# EasyEDA Pro project WhaleTagRecovery_3v2r1_EasyEDA.epro

# Schematic Schematic

## Sheets
1 MCU: Create Date: 2024-01-31; Page Name: MCU; Project Name: RecoveryBoard_W24Edits; Schematic Name: Schematic; Update Date: 2024-02-20; Company: EasyEDA.com; Drawed: EasyEDA Pro; Page Size: A4; Part Number: JLCPCB-002; Reviewed: EasyEDA Pro; Version: V2.3
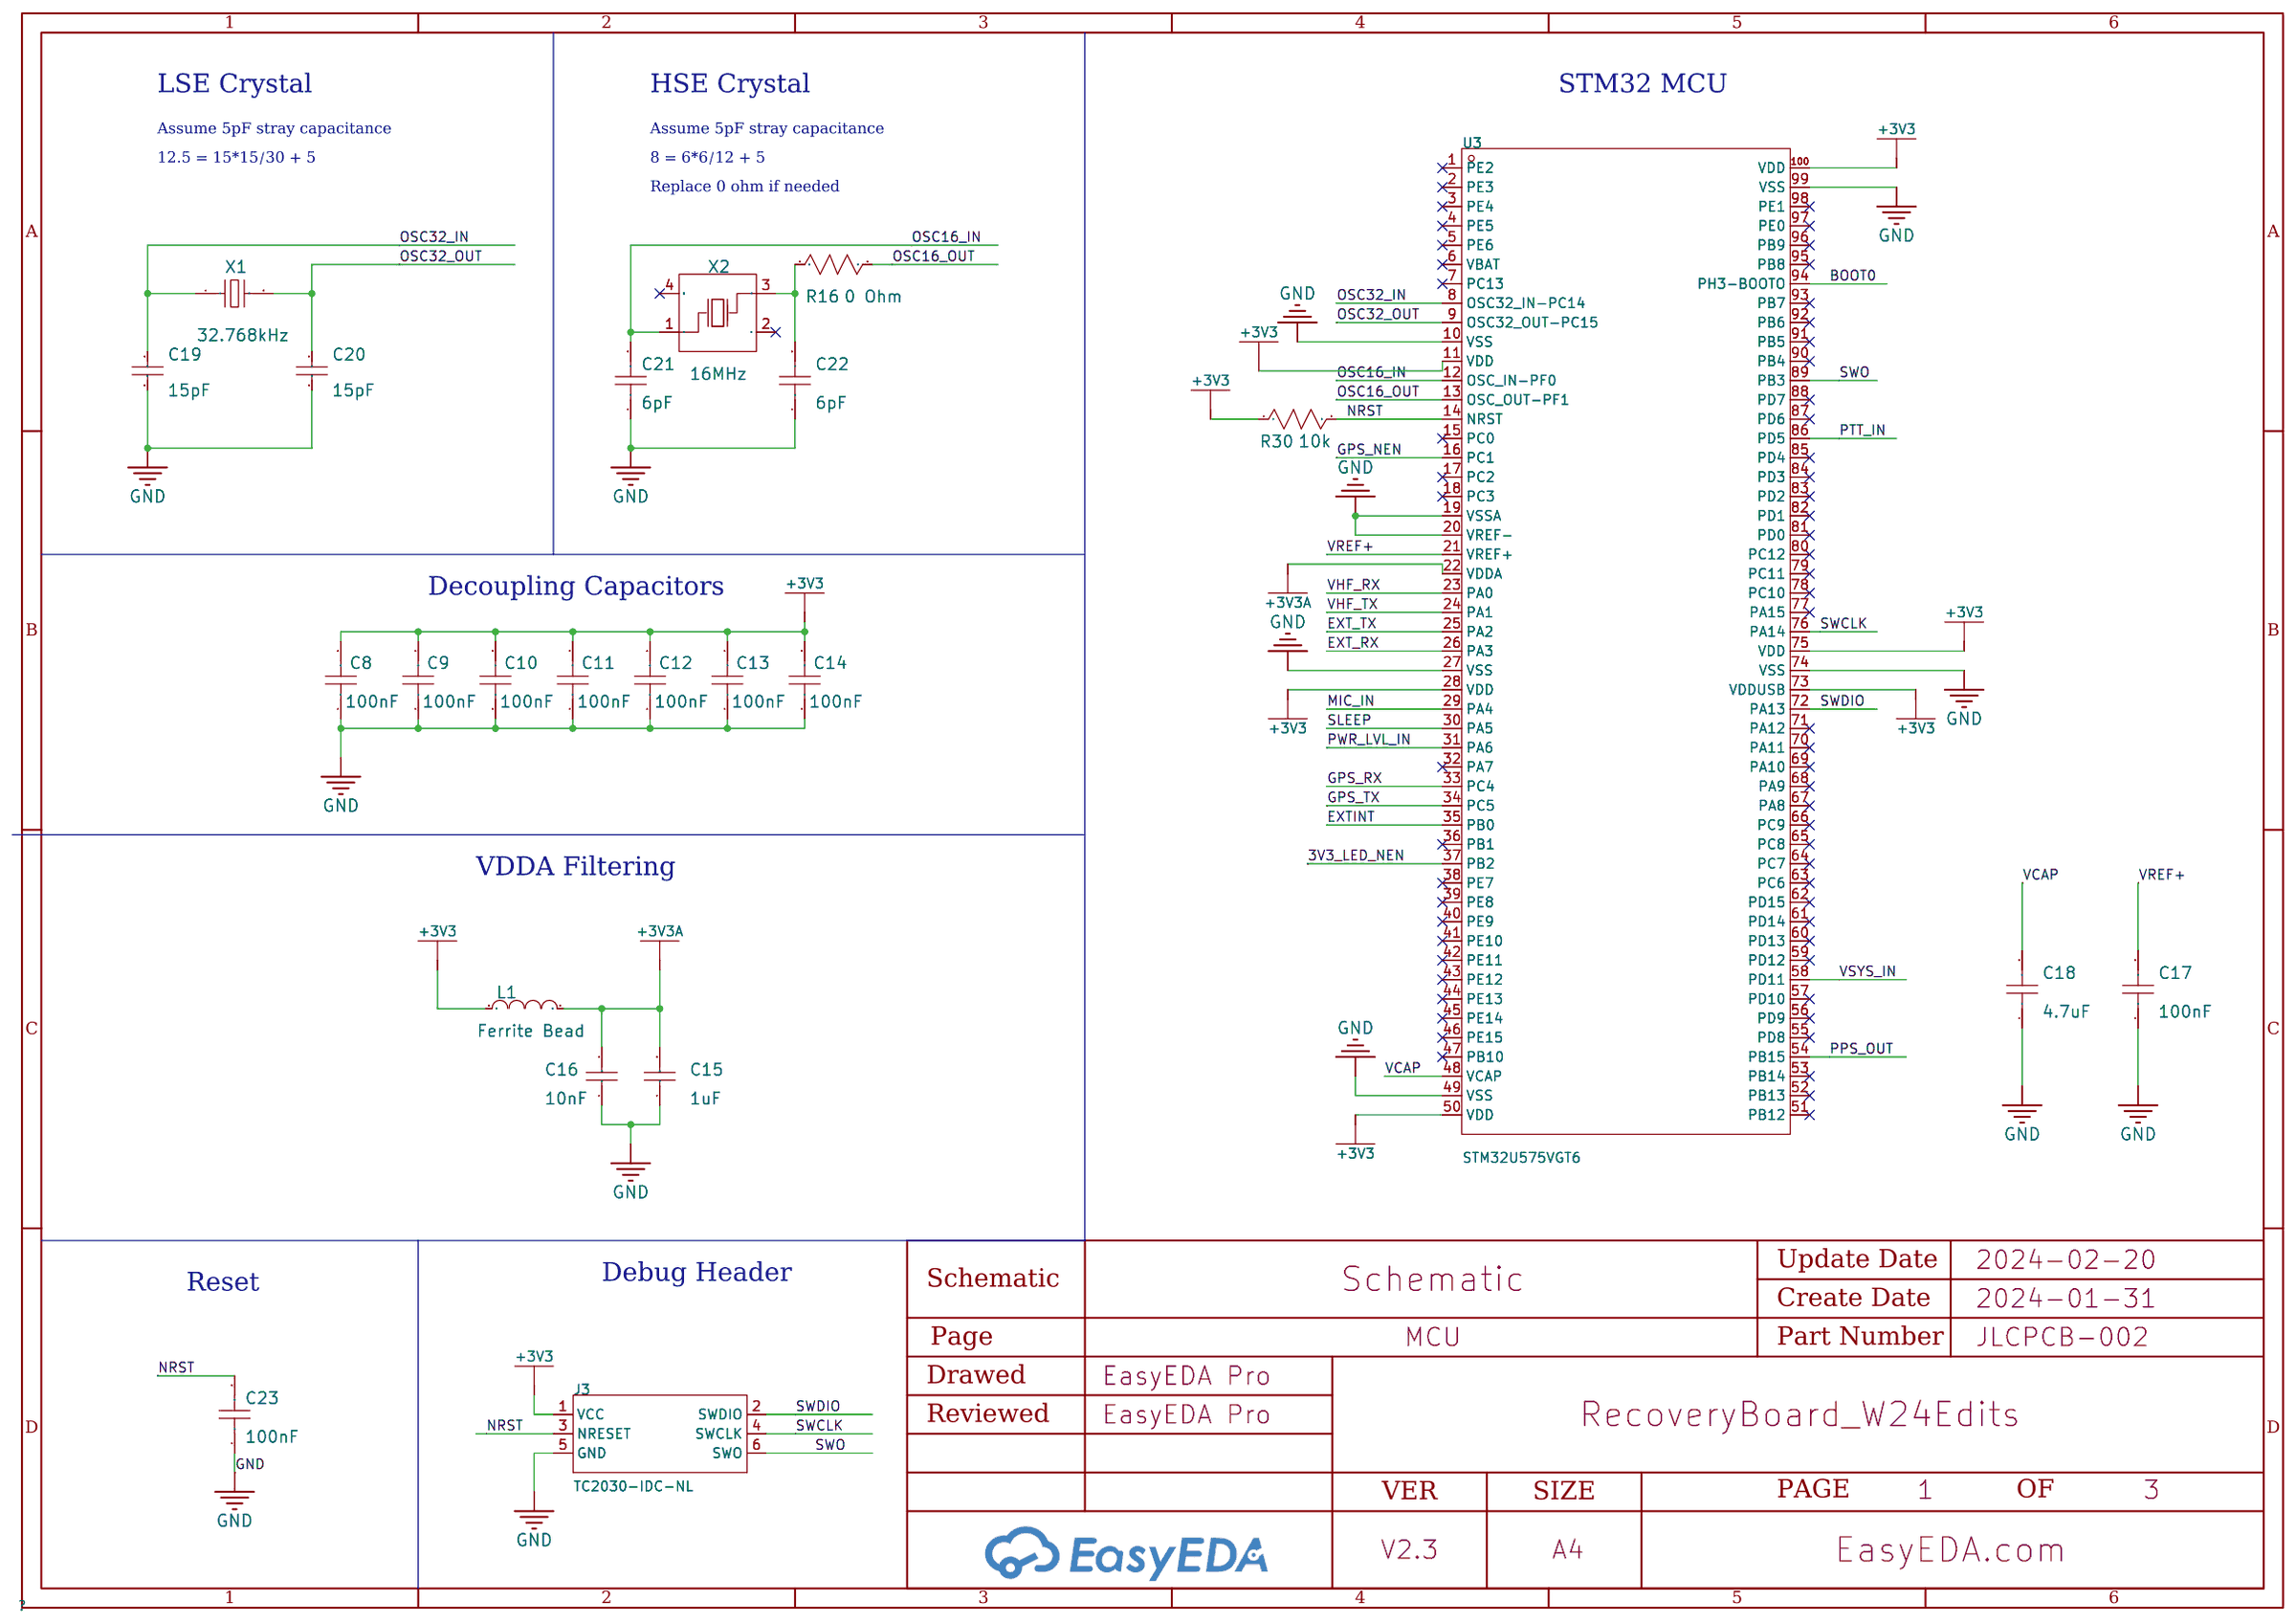
[diagram p0: MCU]
2 Recovery: Page Name: Recovery; Update Date: 2024-04-04
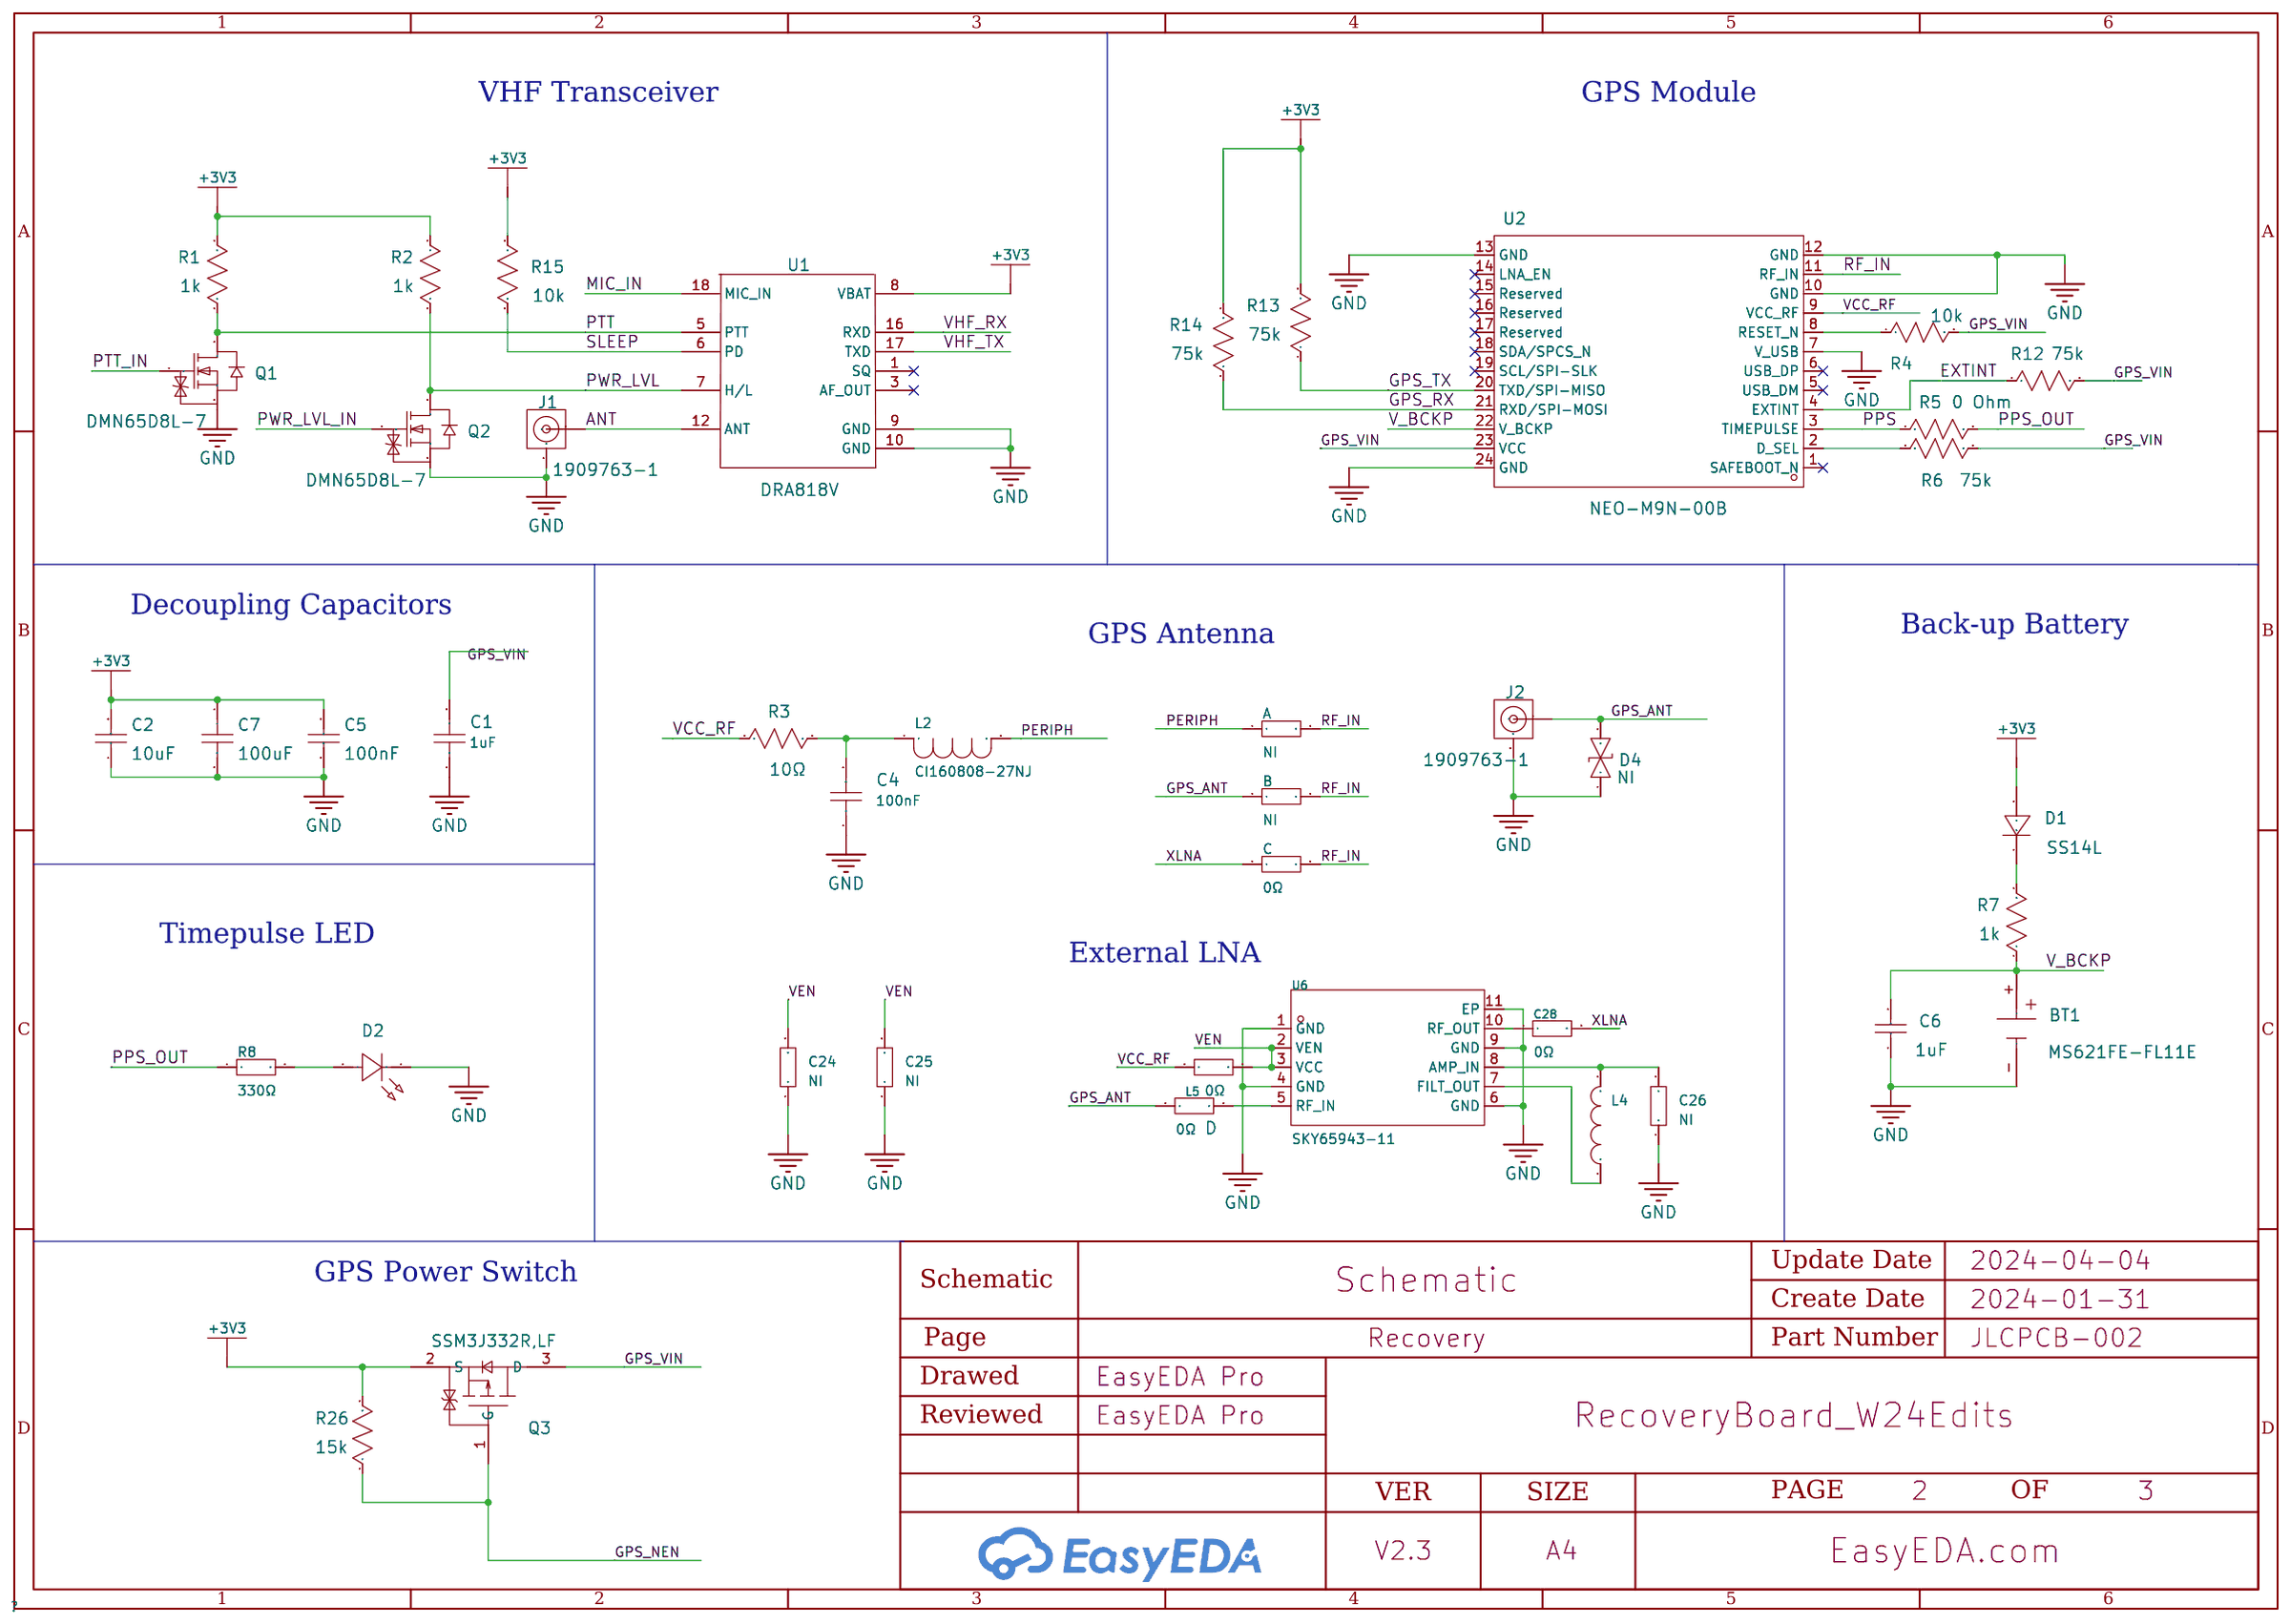
[diagram p1: Recovery]
3 Power: Page Name: Power
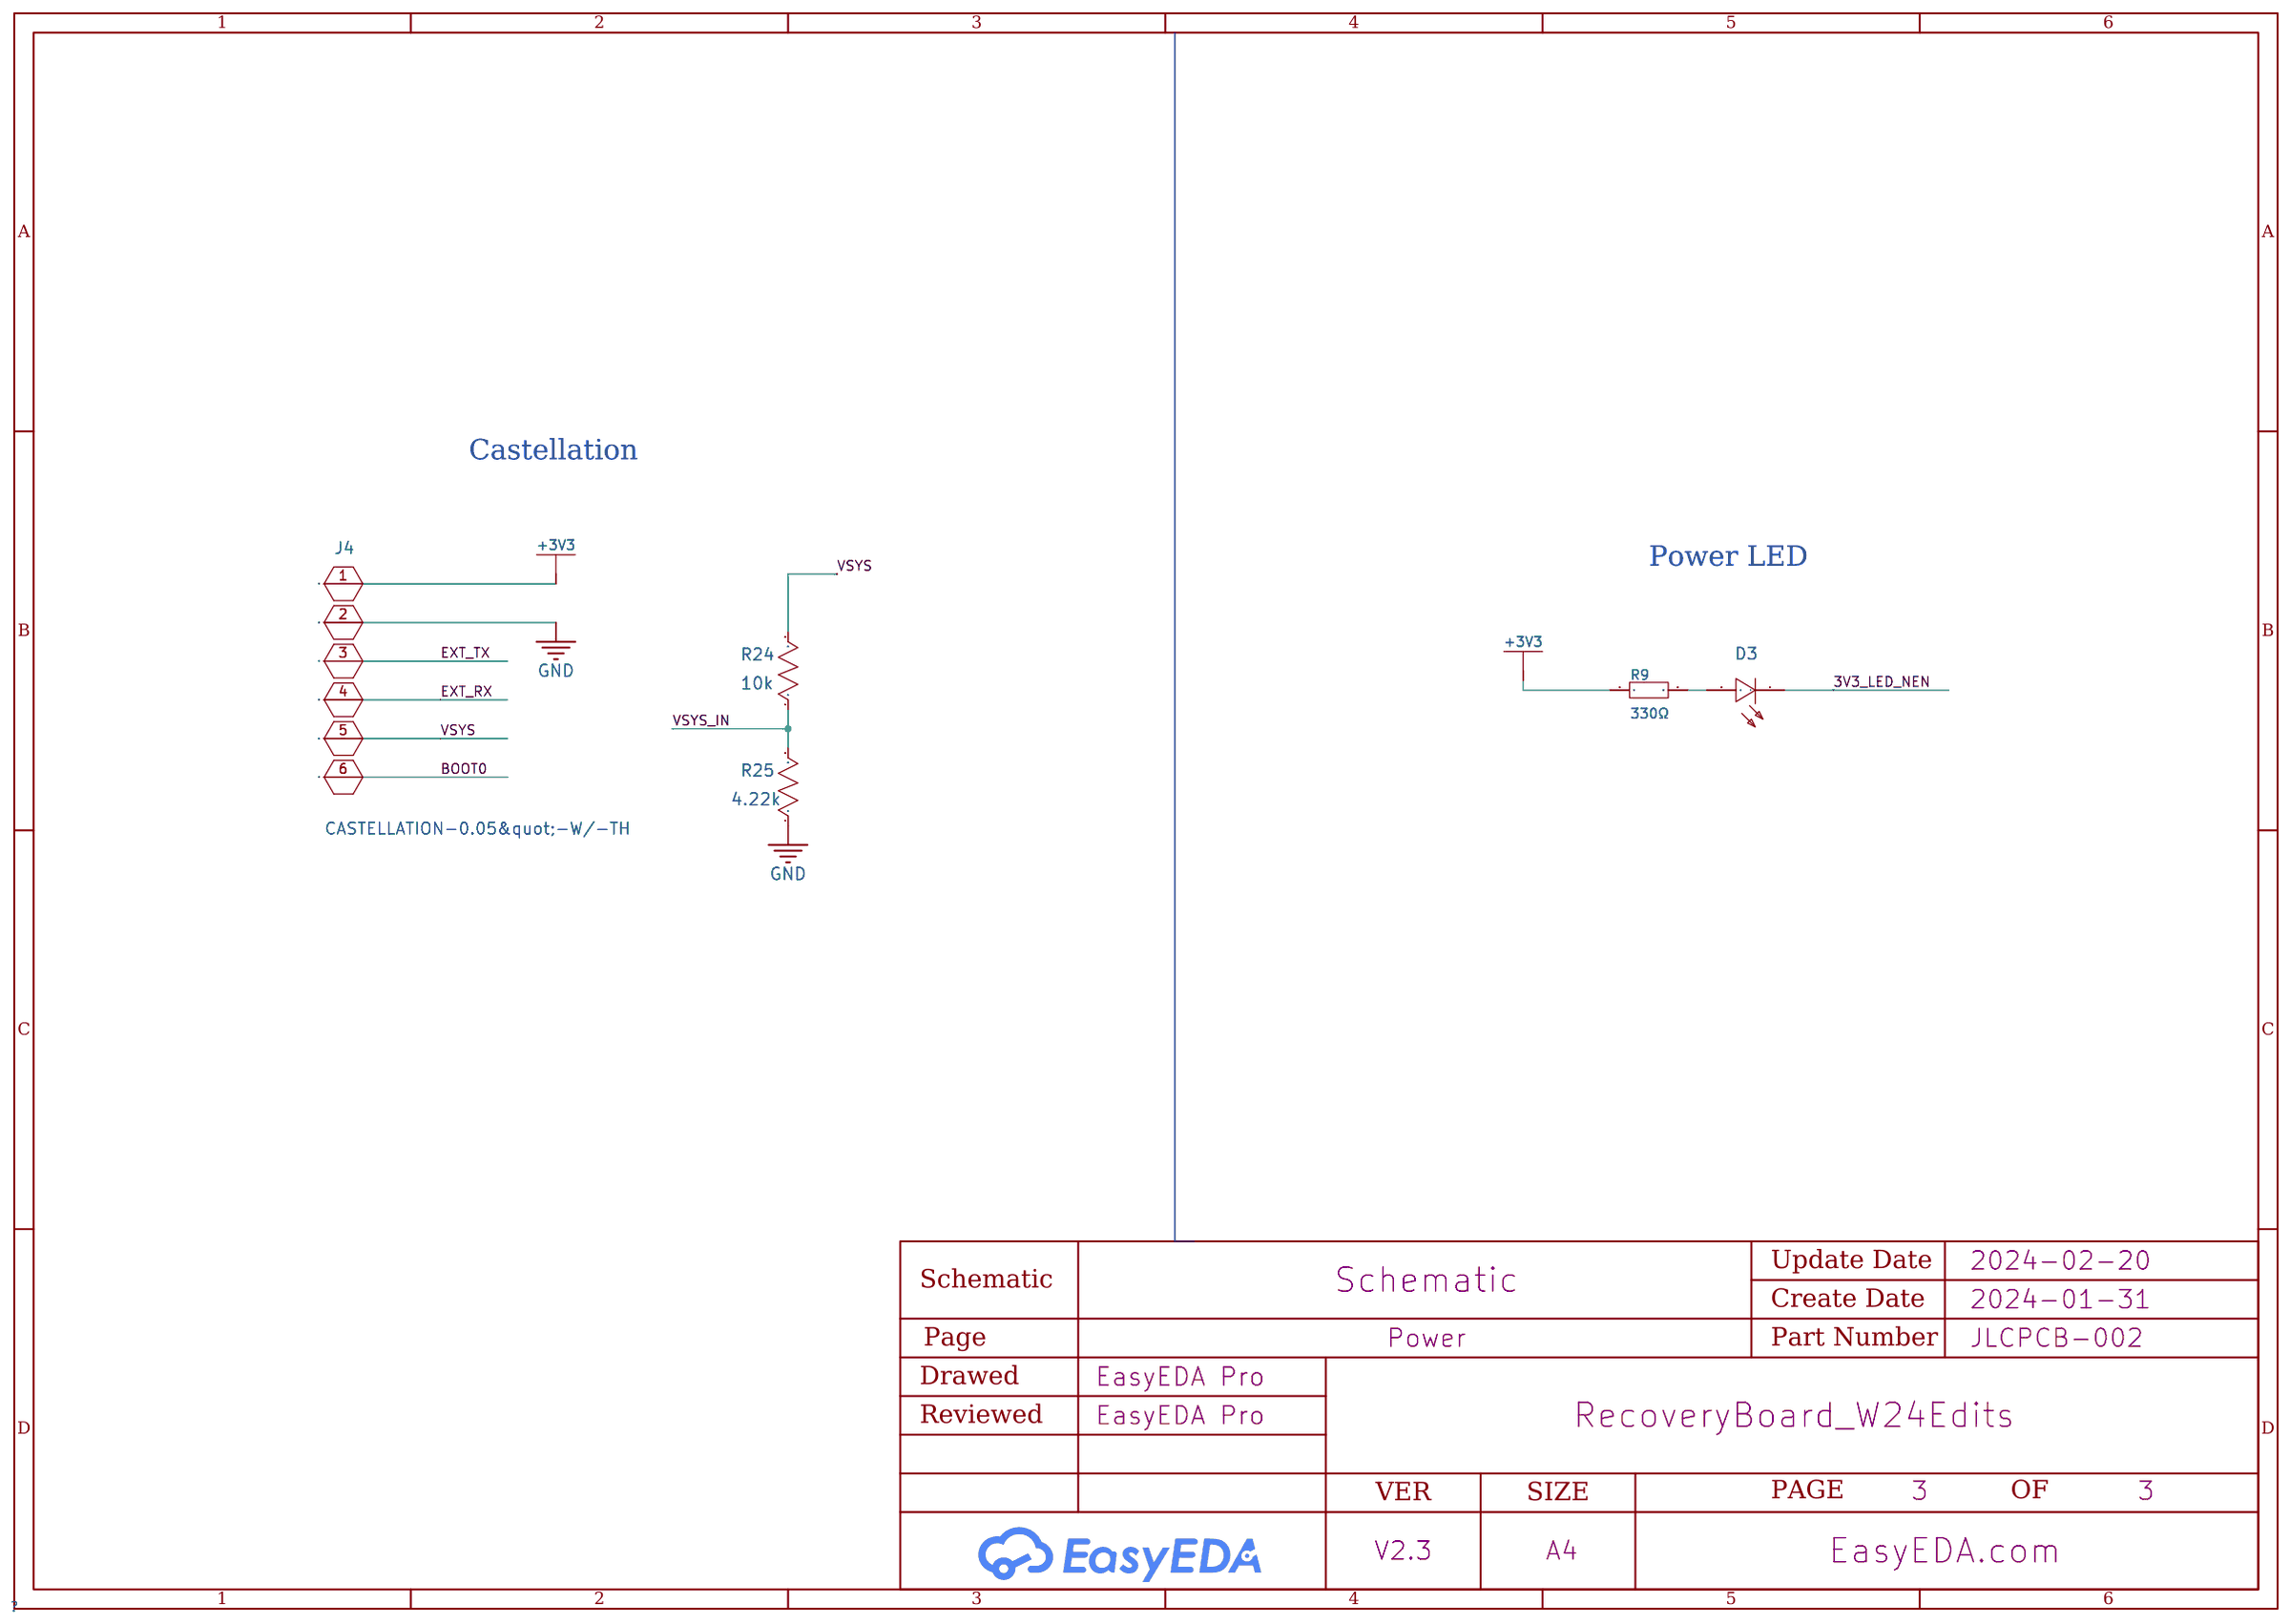
[diagram p2: Power]

## Parts
sheet MCU
C8  100nF  [C0402]
C9  100nF  [C0402]
C10  100nF  [C0402]
C11  100nF  [C0402]
C12  100nF  [C0402]
C13  100nF  [C0402]
C14  100nF  [C0402]
C15  1uF  [C0402]
C16  10nF  [C0402]
C17  100nF  [C0402]
C18  4.7uF  [C0603]
C19  15pF  [C0402]
C20  15pF  [C0402]
C21  6pF  [C0402]
C22  6pF  [C0402]
C23  100nF  [C0402]
J3  TC2030-IDC-NL  [TC2030-IDC-NL]
L1  120R  [L0603]
R16  0 Ohm  [R0603]
R30  10k  [R0603]
U3  STM32U575VGT6  [LQFP-100_L14.0-W14.0-P0.50-LS16.0-BL]
X1  32.768kHz  [OSC-SMD_L3.2-W1.5]
X2  16MHz  [CRYSTAL-SMD_4P-L2.5-W2.0-BL-A]
sheet Power
D3  16-213/SDRC/S530-A3/TR8  [LED0402-RD]
J4  CASTELLATION-0.05&quot;-W/-TH  [CASTELLATION-0.05"-W/-TH]
R9  330Ω  [R0603]
R24  10k  [R0402]
R25  4.22k  [R0402]
sheet Recovery
A  NI  [R0402]  (no BOM)
B  NI  [R0402]  (no BOM)
BT1  MS621FE-FL11E  [MS621FE-FL11E]
C  0Ω  [R0402]
C1  1uF  [C0402]
C2  10uF  [C0603]
C4  100nF  [C0402]
C5  100nF  [C0402]
C6  1uF  [C0402]
C7  100uF  [C1210]
C24  NI  [R0402]  (no BOM)
C25  NI  [R0402]  (no BOM)
C26  NI  [R0402]  (no BOM)
C28  0Ω  [R0402]
D  0Ω  [R0402]
D1  SS14L  [SMA_L4.4-W2.6-LS5.0-RD]
D2  16-213/BHC-ZL1M2B6Y/3T  [LED0402-RD_BLUE]
D4  NI  [SOD-323_L1.8-W1.3-LS2.5-BI]  (no BOM)
J1  1909763-1  [ANT-SMD_1909763-1]
J2  1909763-1  [ANT-SMD_1909763-1]
L2  CI160808-27NJ  [IND_BOURNS_CI160808]
L4  -  [INDC1006X60N]
L5  0Ω  [R0402]
Q1  DMN65D8L-7  [SOT-23-3_L3.0-W1.7-P0.95-LS2.9-BR]
Q2  DMN65D8L-7  [SOT-23-3_L3.0-W1.7-P0.95-LS2.9-BR]
Q3  SSM3J332R,LF  [SOT-23F_L2.9-W1.8-P0.95-LS2.4-BR]
R1  1k  [R0603]
R2  1k  [R0603]
R3  10Ω  [R0603]
R4  10k  [R0603]
R5  0 Ohm  [R0603]
R6  75k  [R0603]
R7  1k  [R0603]
R8  330Ω  [R0603]
R12  75k  [R0603]
R13  75k  [R0603]
R14  75k  [R0603]
R15  10k  [R0603]
R26  15k  [R0402]
U1  DRA818V  [DORJI_DRA818V]
U2  NEO-M9N-00B  [GPSM-SMD_24P-L16.0-W12.2-P1.10-BL]
U6  SKY65943-11  [MCM-10_L2.5-W2.5-P0.50-BL-EP]

## Library data of the parts
C8-C14 C17 C23 = GRM155R71C104KA88D: Supplier: LCSC; Manufacturer: muRata(村田); Supplier Part: C71629; JLCPCB Part Class: ExtendedPart
C6 C15 = GRM155R61E105KA12D: Supplier: LCSC; Manufacturer: muRata(村田); Supplier Part: C77009; JLCPCB Part Class: ExtendedPart
C16 = GRM155R71H103KA88D: Supplier: LCSC; Manufacturer: muRata(村田); Supplier Part: C77019; JLCPCB Part Class: ExtendedPart
C18 = GRM188R61A475KE15D: Supplier: LCSC; Manufacturer: muRata(村田); Supplier Part: C71633; JLCPCB Part Class: ExtendedPart
C19 C20 = GJM1555C1H150FB01D: Supplier: LCSC; Supplier Part: C441742; Manufacturer: muRata(村田); JLCPCB Part Class: ExtendedPart
C21 C22 = GCM1555C1H6R0BA16D: Supplier: LCSC; Supplier Part: C437443; Manufacturer: muRata(村田); JLCPCB Part Class: ExtendedPart
J3 = TC2030-IDC-NL: _: 3
L1 = BLM18PG121SN1D: Supplier: LCSC; Supplier Part: C14709; Manufacturer: muRata(村田); JLCPCB Part Class: ExtendedPart
R5 R16 = 0603WAF0000T5E: Supplier: LCSC
R4 R15 R30 = RC0603FR-0710KL: Supplier: LCSC
U3 = STM32U575VGT6: Supplier Part: C5270988; Manufacturer: ST(意法半导体); Supplier Footprint: LQFP-100(14x14); JLCPCB Part Class: ExtendedPart; Supplier: LCSC
X1 = X321532768KGD2SI: Supplier: LCSC; Supplier Part: C620155; Manufacturer: YXC(扬兴晶振); JLCPCB Part Class: ExtendedPart
X2 = NX2520SA-16MHZ-STD-CSW-5: Supplier: LCSC; Supplier Part: C280836; Manufacturer: NDK; JLCPCB Part Class: ExtendedPart
D3 = 16-213SDRC/S530-A3/TR8: Supplier: LCSC; Manufacturer: EVERLIGHT(亿光); Supplier Part: C71911; JLCPCB Part Class: ExtendedPart
J4 = CASTELLATION-0.05"-W/-TH
R8 R9 = RC0603JR-07330RL: Type:Thick Film Resistors Resistance: Tolerance:±5% Tolerance:±5% Power(Watts): Overload Voltage (Max): Temperature Coefficient:±100ppm/℃ Temperature Coefficient:±100ppm/℃ Operating Temperature Range:-55℃~+155℃ Operating Temperature Range:-55℃~+155℃; LCSC Part Name: 厚膜电阻 330Ω ±5% 100mW; Supplier Part: C105879; Manufacturer: YAGEO(国巨); Supplier Footprint: 0603; JLCPCB Part Class: Extended Part; Datasheet: https://atta.szlcsc.com/upload/public/pdf/source/20170705/1499242708629.pdf; Supplier: LCSC; Type: Thick Film Resistors; Tolerance: ±5%; Temperature Coefficient: ±100ppm/℃; Operating Temperature Range: -55℃~+155℃
R24 = RC0603FR-0710RL: Supplier: LCSC; Manufacturer Part: TR0402D10KQ1025
R25 = RC0603FR-0710RL: Supplier: LCSC; Manufacturer Part: RT0402BRD074K22L
A B C C24-C26 C28 D L5 = ERJ2GE0R00X: Type:Thick Film Resistors Resistance: Power(Watts): Overload Voltage (Max):- Temperature Coefficient:-100ppm/℃~+600ppm/℃ Temperature Coefficient:-100ppm/℃~+600ppm/℃ Operating Temperature Range:-55℃~+155℃ Operating Temperature Range:-55℃~+155℃; LCSC Part Name: 0Ω 100mW 厚膜电阻; Supplier Part: C242160; Manufacturer: PANASONIC(松下); Supplier Footprint: 0402; JLCPCB Part Class: Extended Part; Datasheet: https://atta.szlcsc.com/upload/public/pdf/source/20181106/C242160_CA6E41971DE5A1DCD79442F3CF334CD6.pdf; Supplier: LCSC; Type: Thick Film Resistors; Temperature Coefficient: -100ppm/℃~+600ppm/℃; Operating Temperature Range: -55℃~+155℃
BT1 = MS621FE-FL11E
C1 = CC0402KRX5R7BB105: Capacitance: Tolerance:±10% Tolerance:±10% Voltage Rated: Temperature Coefficient:; LCSC Part Name: 1uF ±10% 16V; Supplier Part: C325464; Manufacturer: YAGEO(国巨); Supplier Footprint: 0402; JLCPCB Part Class: Extended Part; Datasheet: https://atta.szlcsc.com/upload/public/pdf/source/20181031/C325464_552E8C5A0F4FE3FC31E3609DB4A74E24.pdf; Supplier: LCSC; Tolerance: ±10%
C2 = GRM188R60G106ME47D: Supplier: LCSC; Manufacturer: muRata(村田); Supplier Part: C97885; JLCPCB Part Class: ExtendedPart; Check: true
C4 = GCM155R71C104KA55J: Capacitance: Tolerance:±10% Tolerance:±10% Voltage Rated: Temperature Coefficient:; LCSC Part Name: 100nF ±10% 16V; Supplier Part: C2655418; Manufacturer: muRata(村田); Supplier Footprint: 0402; JLCPCB Part Class: Extended Part; Datasheet: https://atta.szlcsc.com/upload/public/pdf/source/20210701/42090801FDE37D0E45AFF657247F4A08.pdf; Supplier: LCSC; Tolerance: ±10%
C5 = CC0402ZRY5V7BB104: Supplier: LCSC; Manufacturer: YAGEO(国巨); Supplier Part: C106209; JLCPCB Part Class: ExtendedPart
C7 = GRM32ER60J107ME20L: Supplier: LCSC; Manufacturer: muRata(村田); Supplier Part: C88154; JLCPCB Part Class: ExtendedPart
D1 = SS14L_R1_00001: Supplier: LCSC; Manufacturer: PANJIT(强茂); Supplier Part: C125883; JLCPCB Part Class: ExtendedPart
D2 = 16-213/BHC-ZL1M2B6Y/3T: Supplier: LCSC; Supplier Part: C2844007; Manufacturer: EVERLIGHT(亿光); JLCPCB Part Class: ExtendedPart
D4 = LESD3Z5.0CMT1G: Supplier Part: C172405; Supplier: LCSC; Manufacturer: LRC(乐山无线电); JLCPCB Part Class: ExtendedPart
J1 J2 = 1909763-1: Supplier: LCSC; Supplier Part: C392444; Manufacturer: TEConnectivity(美国泰科); JLCPCB Part Class: ExtendedPart
L2 = CI160808-27NJ_IND_BOURNS_CI160808
L4 = LQW15AN9N1J00D_
Q1 Q2 = DMN65D8L-7: Supplier: LCSC; Supplier Part: C155341; Manufacturer: DIODES(美台); JLCPCB Part Class: ExtendedPart
Q3 = SSM3J332R,LF: link: https://list.szlcsc.com/catalog/381.html; Supplier: LCSC; Manufacturer: TOSHIBA; Supplier Part: C146367; JLCPCB Part Class: ExtendedPart
R1 R2 R7 = 1k
R3 = ESR03EZPJ100: Type:Thick Film Resistors Resistance: Tolerance:±5% Tolerance:±5% Power(Watts):250mW Overload Voltage (Max): Temperature Coefficient:±200ppm/℃ Temperature Coefficient:±200ppm/℃ Operating Temperature Range:-55℃~+155℃ Operating Temperature Range:-55℃~+155℃; LCSC Part Name: 厚膜电阻 10Ω ±5% 250mW; Supplier Part: C253327; Manufacturer: ROHM(罗姆); Supplier Footprint: 0603; JLCPCB Part Class: Extended Part; Datasheet: https://atta.szlcsc.com/upload/public/pdf/source/20180719/C253345_B76D5E071FE5F975028EF7B0C44FE2A9.pdf; Supplier: LCSC; Type: Thick Film Resistors; Tolerance: ±5%; Power(Watts): 250mW; Temperature Coefficient: ±200ppm/℃; Operating Temperature Range: -55℃~+155℃
R6 R12-R14 = RC0603FR-0775KL
R26 = RC0603FR-0710RL: Supplier: LCSC; Manufacturer Part: 0402WGF1502TCE
U1 = DRA818V
U2 = NEO-M9N-00B: Supplier: LCSC; Supplier Part: C5119087; Manufacturer: null; JLCPCB Part Class: ExtendedPart
U6 = SKY65943-11: Frequency Range:1.559GHz~1.606GHz Frequency Range:1.559GHz~1.606GHz Applications:Galileo,GLONASS,GNSS,GPS; Supplier Part: C2654442; Manufacturer: SKYWORKS; Supplier Footprint: MCM-10(2.5x2.5); JLCPCB Part Class: Extended Part; Supplier: LCSC; Frequency Range: 1.559GHz~1.606GHz; Applications: Galileo,GLONASS,GNSS,GPS

## Nets
3V3_LED_NEN: D3.1(-) U3.37(PB2)
+3V3: C2.2 C5.2 C7.1 C8.2 C9.2 C10.2 C11.2 C12.2 C13.2 C14.2 D1.2(A) J3.1(VCC) J4.1 L1.2 Q3.2(S) R1.2 R2.2 R9.1 R13.2 R14.2 R15.2 R26.2 R30.1 U1.8(VBAT) U3.11(VDD) U3.28(VDD) U3.50(VDD) U3.73(VDDUSB) U3.75(VDD) U3.100(VDD)
+3V3A: C15.2 C16.2 L1.1 U3.22(VDDA)
GND: BT1.- C1.1 C2.1 C4.1 C5.1 C6.1 C7.2 C8.1 C9.1 C10.1 C11.1 C12.1 C13.1 C14.1 C15.1 C16.1 C17.1 C18.1 C19.1 C20.1 C21.1 C22.1 C23.1 C24.1 C25.1 C26.1 D2.1(K) D4.1 J1.2 J2.2 J3.5(GND) J4.2(1) Q1.2(S) Q2.2(S) R25.1 U1.9(GND) U1.10(GND) U2.7(V_USB) U2.10(GND) U2.12(GND) U2.13(GND) U2.24(GND) U3.10(VSS) U3.19(VSSA) U3.20(VREF-) U3.27(VSS) U3.49(VSS) U3.74(VSS) U3.99(VSS) U6.1(GND) U6.4(GND) U6.6(GND) U6.9(GND) U6.11(EP)
VCC_RF: L5.1 R3.1 U2.9(VCC_RF)
ANT: J1.1 U1.12(ANT)
BOOT0: J4.6(1) U3.94(PH3-BOOTO)
EXT_RX: J4.4(1) U3.26(PA3)
EXT_TX: J4.3(1) U3.25(PA2)
EXTINT: R12.1 U2.4(EXTINT) U3.35(PB0)
GPS_ANT: B.1 D.1 D4.2 J2.1
GPS_NEN: Q3.1(G) R26.1 U3.16(PC1)
GPS_RX: R14.1 U2.21(RXD/SPI-MOSI) U3.33(PC4)
GPS_TX: R13.1 U2.20(TXD/SPI-MISO) U3.34(PC5)
GPS_VIN: C1.2 Q3.3(D) R4.2 R6.2 R12.2 U2.23(VCC)
MIC_IN: U1.18(MIC_IN) U3.29(PA4)
NRST: C23.2 J3.3(NRESET) R30.2 U3.14(NRST)
OSC16_IN: C21.2 U3.12(OSC_IN-PF0) X2.1
OSC16_OUT: R16.2 U3.13(OSC_OUT-PF1)
OSC32_IN: C19.2 U3.8(OSC32_IN-PC14) X1.1
OSC32_OUT: C20.2 U3.9(OSC32_OUT-PC15) X1.2
PERIPH: A.1 L2.2
PPS: R5.1 U2.3(TIMEPULSE)
PPS_OUT: R5.2 R8.1 U3.54(PB15)
PTT: Q1.3(D) R1.1 U1.5(PTT)
PTT_IN: Q1.1(G) U3.86(PD5)
PWR_LVL: Q2.3(D) R2.1 U1.7(H/L)
PWR_LVL_IN: Q2.1(G) U3.31(PA6)
RESET_N: R4.1 U2.8(RESET_N)
RF_IN: A.2 B.2 C.2 U2.11(RF_IN)
SLEEP: R15.1 U1.6(PD) U3.30(PA5)
SWCLK: J3.4(SWCLK) U3.76(PA14)
SWDIO: J3.2(SWDIO) U3.72(PA13)
SWO: J3.6(SWO) U3.89(PB3)
V_BCKP: BT1.+ C6.2 R7.1 U2.22(V_BCKP)
VCAP: C18.2 U3.48(VCAP)
VEN: C24.2 C25.2 L5.2 U6.2(VEN) U6.3(VCC)
VHF_RX: U1.16(RXD) U3.23(PA0)
VHF_TX: U1.17(TXD) U3.24(PA1)
VREF+: C17.2 U3.21(VREF+)
VSYS: J4.5(1) R24.2
VSYS_IN: R24.1 R25.2 U3.58(PD11)
XLNA: C.1 C28.2
$1N2852: C22.2 R16.1 X2.3(2)
$2N1313: R6.1 U2.2(D_SEL)
$2N1327: D1.1(C) R7.2
$2N11296: C4.2 L2.1 R3.2
$2N11769: C28.1 U6.10(RF_OUT)
$2N11796: D.2 U6.5(RF_IN)
$2N14994: D2.2(A) R8.2
$2N19088: L4.1 U6.7(FILT_OUT)
$2N19111: C26.2 L4.2 U6.8(AMP_IN)
$3N108: D3.2(+) R9.2

Not connected (* = marked no-connect by the designer): U1 1(SQ)* 3(AF_OUT)*; U2 1(SAFEBOOT_N)* 5(USB_DM)* 6(USB_DP)* 14(LNA_EN)* 15(Reserved)* 16(Reserved)* 17(Reserved)* 18(SDA/SPCS_N)* 19(SCL/SPI-SLK)*; U3 1(PE2)* 2(PE3)* 3(PE4)* 4(PE5)* 5(PE6)* 6(VBAT)* 7(PC13)* 15(PC0)* 17(PC2)* 18(PC3)* 32(PA7)* 36(PB1)* 38(PE7)* 39(PE8)* 40(PE9)* 41(PE10)* 42(PE11)* 43(PE12)* 44(PE13)* 45(PE14)* 46(PE15)* 47(PB10)* 51(PB12)* 52(PB13)* 53(PB14)* 55(PD8)* 56(PD9)* 57(PD10)* 59(PD12)* 60(PD13)* 61(PD14)* 62(PD15)* 63(PC6)* 64(PC7)* 65(PC8)* 66(PC9)* 67(PA8)* 68(PA9)* 69(PA10)* 70(PA11)* 71(PA12)* 77(PA15)* 78(PC10)* 79(PC11)* 80(PC12)* 81(PD0)* 82(PD1)* 83(PD2)* 84(PD3)* 85(PD4)* 87(PD6)* 88(PD7)* 90(PB4)* 91(PB5)* 92(PB6)* 93(PB7)* 95(PB8)* 96(PB9)* 97(PE0)* 98(PE1)*; X2 2(GND)* 4(GND)*

## Notes on the sheets
sheet 1
- LSE Crystal
- HSE Crystal
- STM32 MCU
- Assume 5pF stray capacitance
- Assume 5pF stray capacitance
- 12.5 = 15*15/30 + 5
- 8 = 6*6/12 + 5
- Replace 0 ohm if needed
- Decoupling Capacitors
- VDDA Filtering
- Reset
- Debug Header
sheet 2
- VHF Transceiver
- GPS Module
- Decoupling Capacitors
- GPS Antenna
- Back-up Battery
- Timepulse LED
- External LNA
- GPS Power Switch
sheet 3
- Castellation
- Power LED

# Board PCB
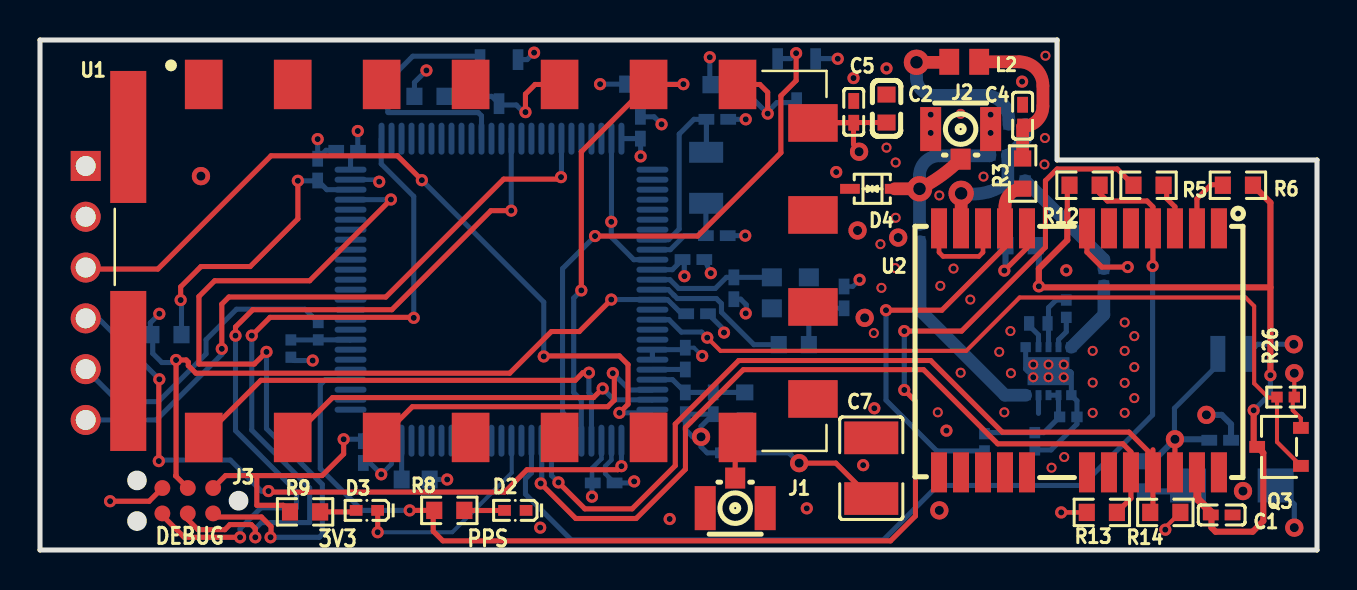
[diagram p3: board, top side]
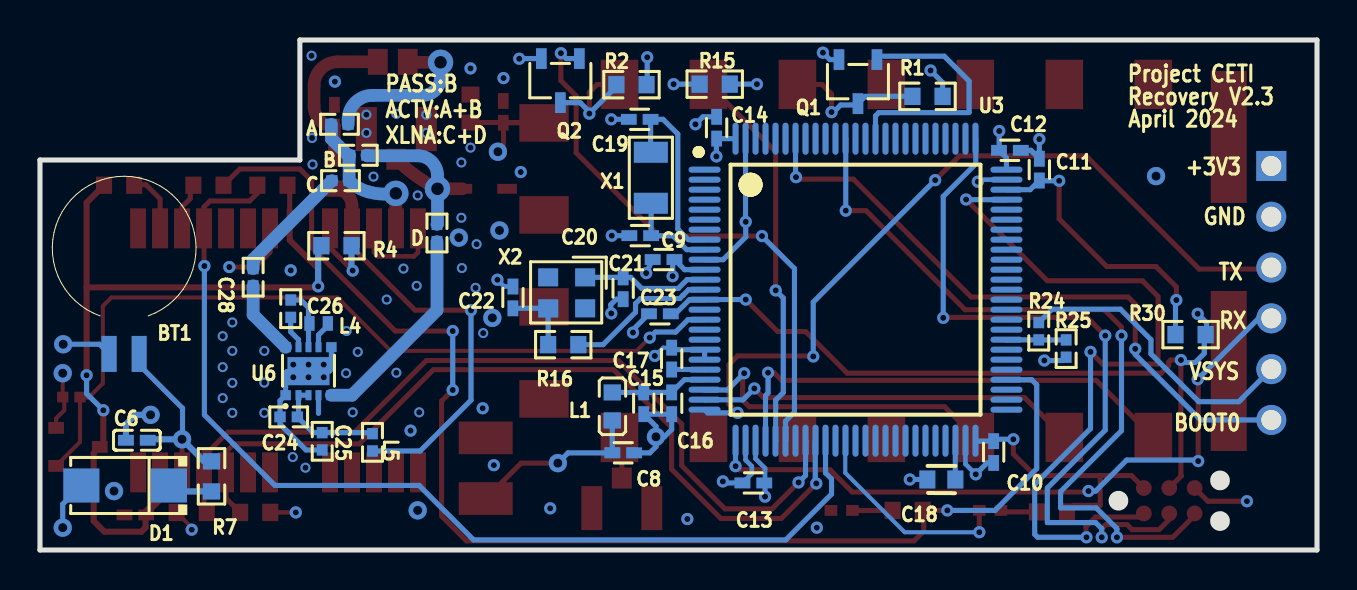
[diagram p4: board, bottom side, seen from below]

Outline 63.88 x 25.5 mm; copper layers: Top Layer, Inner1, Inner2, Bottom Layer. Coordinates in mm from the lower left corner of the outline.
Outline path: 0,25.5 50.88,25.5 50.88,19.5 63.88,19.5 63.88,0 0,0 0,25.5
Stack: Top Layer 0.035mm 外层铜厚1oz / Dielectric1 0.2104mm 7628 RC49% 8.6mil / Inner1 0.0152mm 内层铜厚 / Dielectric2 1.065mm 1.1mm H/HOZ 含铜 / Inner2 0.0152mm 内层铜厚 / Dielectric3 0.2104mm 7628 RC49% 8.6mil / Bottom Layer 0.035mm 外层铜厚1oz

## Design rules (mm)
template: Custom Config
spacing copperThickness1oz (default): track to track 0.102, other pairs 0 to 0.3
spacing copperThickness2oz: track to track 0.203, other pairs 0.152 to 0.3
track width copperThickness1oz (default): min 0.127, default 0.254, max 2.54
track width copperThickness2oz: min 0.203, default 0.254, max 2.54
differential pair differentialPair (default): width min 0.127, default 0.254, max 2.54; gap min 0.152, default 0.152
via viaSize (default): diameter min 0.5, default 0.61, max 10; hole min 0.3, default 0.305, max 6.3

## Placement (name value [footprint] x y rotation side)
A  NI  [R0402]  48.89 21.28 0 bottom
B  NI  [R0402]  47.95 19.74 0 bottom
BT1  -  [MS621FE-FL11E]  59.66 9.8 180 bottom
C  0Ω  [R0402]  48.84 18.47 180 bottom
C1  1uF  [C0402]  59.11 1.75 180 top
C2  10uF  [C0603]  42.34 22.07 270 top
C4  100nF  [C0402]  49.15 21.72 270 top
C5  100nF  [C0402]  40.7 21.91 270 top
C6  1uF  [C0402]  59.03 5.49 180 bottom
C7  100uF  [C1210]  41.58 4.09 90 top
C8  100nF  [C0402]  34.7 4.86 0 bottom
C9  100nF  [C0402]  32.68 14.52 180 bottom
C10  100nF  [C0402]  16.17 4.9 90 bottom
C11  100nF  [C0402]  13.89 19.02 270 bottom
C12  100nF  [C0402]  15.36 19.98 0 bottom
C13  100nF  [C0402]  28.19 3.35 180 bottom
C14  100nF  [C0402]  30.03 21.11 270 bottom
C15  1uF  [C0402]  33.67 7.34 90 bottom
C16  10nF  [C0402]  32.28 7.34 90 bottom
C17  100nF  [C0402]  32.28 9.57 270 bottom
C18  4.7uF  [C0603]  18.79 3.53 180 bottom
C19  15pF  [C0402]  33.88 21.53 180 bottom
C20  15pF  [C0402]  33.85 15.72 180 bottom
C21  6pF  [C0402]  34.71 13.09 90 bottom
C22  6pF  [C0402]  40.22 12.63 270 bottom
C23  100nF  [C0402]  32.87 11.81 180 bottom
C24  NI  [R0402]  51.44 6.66 180 bottom
C25  NI  [R0402]  49.76 5.44 90 bottom
C26  NI  [R0402]  51.33 12.06 90 bottom
C28  0Ω  [R0402]  53.21 13.64 90 bottom
D  0Ω  [R0402]  44.02 15.85 270 bottom
D1  SS14L  [SMA_L4.4-W2.6-LS5.0-RD]  59.61 3.23 0 bottom
D2  16-213/BHC-ZL1M2B6Y/3T  [LED0402-RD_BLUE]  23.77 1.98 180 top
D3  16-213/SDRC/S530-A3/TR8  [LED0402-RD]  16.35 1.98 180 top
D4  NI  [SOD-323_L1.8-W1.3-LS2.5-BI]  41.63 18.06 0 top
J1  1909763-1  [ANT-SMD_1909763-1]  34.77 2.84 0 top
J2  1909763-1  [ANT-SMD_1909763-1]  46.05 20.29 180 top
J3  -  [TC2030-IDC-NL]  8.66 1.83 180 top
J4  CASTELLATION-0.05&quot;-W/-TH  [CASTELLATION-0.05"-W/-TH]  0 23.01 0 top
L1  120R  [L0603]  35.25 7.18 270 bottom
L2  CI160808-27NJ  [IND_BOURNS_CI160808]  46.23 24.41 180 top
L4  -  [INDC1006X60N]  49.94 11.33 0 bottom
L5  0Ω  [R0402]  47.24 5.39 90 bottom
Q1  DMN65D8L-7  [SOT-23-3_L3.0-W1.7-P0.95-LS2.9-BR]  22.96 23.42 90 bottom
Q2  DMN65D8L-7  [SOT-23-3_L3.0-W1.7-P0.95-LS2.9-BR]  37.85 23.47 90 bottom
Q3  SSM3J332R,LF  [SOT-23F_L2.9-W1.8-P0.95-LS2.4-BR]  61.98 5.16 0 top
R1  1k  [R0603]  19.48 22.68 180 bottom
R2  1k  [R0603]  34.29 23.27 180 bottom
R3  10Ω  [R0603]  49.15 18.82 90 top
R4  10k  [R0603]  49.05 15.21 0 bottom
R5  0 Ohm  [R0603]  55.45 18.24 180 top
R6  75k  [R0603]  59.92 18.24 0 top
R7  1k  [R0603]  55.3 3.68 270 bottom
R8  330Ω  [R0603]  20.47 1.98 0 top
R9  330Ω  [R0603]  13.26 1.91 0 top
R12  75k  [R0603]  52.25 18.24 180 top
R13  75k  [R0603]  53.11 1.88 180 top
R14  75k  [R0603]  56.29 1.88 0 top
R15  10k  [R0603]  30.12 23.29 180 bottom
R16  0 Ohm  [R0603]  37.7 10.27 180 bottom
R24  10k  [R0402]  13.92 10.94 90 bottom
R25  4.22k  [R0402]  12.55 10.07 90 bottom
R26  15k  [R0402]  62.31 7.65 0 top
R30  10k  [R0603]  6.32 10.77 180 bottom
U1  DRA818V  [DORJI_DRA818V]  21.54 14.45 0 top
U2  NEO-M9N-00B  [GPSM-SMD_24P-L16.0-W12.2-P1.10-BL]  51.97 9.98 90 top
U3  STM32U575VGT6  [LQFP-100_L14.0-W14.0-P0.50-LS16.0-BL]  23.08 13.02 270 bottom
U6  SKY65943-11  [MCM-10_L2.5-W2.5-P0.50-BL-EP]  50.44 8.94 180 bottom
X1  32.768kHz  [OSC-SMD_L3.2-W1.5]  33.32 18.61 270 bottom
X2  16MHz  [CRYSTAL-SMD_4P-L2.5-W2.0-BL-A]  37.53 12.86 0 bottom

## Footprints (pads in the part's own frame, mm; a bottom-side part is the same pattern mirrored in y, then rotated)
ANT-SMD_1909763-1
  rect 1x1.05 smd: 1(0,0.751)
  rect 1.05x2.2 smd: 2(-1.5,-0.751) 2(1.5,-0.751)
C0402
  rect 0.79x0.54 smd: 1(-0.545,0) 2(0.545,0)
C0603
  rect 0.8x0.9 smd: 1(-0.7,0) 2(0.7,0)
C1210
  rect 1.635x2.7 smd: 1(-1.518,0) 2(1.518,0)
CASTELLATION-0.05"-W/-TH
  rect 1.5x1.5 hole 1: 1(2.286,-3.81)
  round 1.5 hole 1: 2(2.286,-6.35) 3(2.286,-8.89) 4(2.286,-11.43) 5(2.286,-13.97) 6(2.286,-16.51)
CRYSTAL-SMD_4P-L2.5-W2.0-BL-A
  rect 1x0.9 smd: 1(-0.925,-0.775) 2(0.925,-0.775) 3(0.925,0.775) 4(-0.925,0.775)
DORJI_DRA818V
  rect 1.88x2.47 smd: 1(-13.35,8.825) 2(-8.9,8.825) 3(-4.45,8.825) 4(0,8.825) 5(4.45,8.825) 6(8.9,8.825) 7(13.35,8.825) 12(13.35,-8.825) 13(8.9,-8.825) 14(4.45,-8.825) 15(0,-8.825) 16(-4.45,-8.825) 17(-8.9,-8.825) 18(-13.35,-8.825)
  rect 2.47x1.88 smd: 8(17.125,6.9) 9(17.125,2.3) 10(17.125,-2.3) 11(17.125,-6.9)
  rect 1.8x6.6 smd: P2(-17.125,6.2)
  rect 1.8x8 smd: P3(-17.125,-5.5)
GPSM-SMD_24P-L16.0-W12.2-P1.10-BL
  rect 2x0.8 smd: 1(6.1,-7) 2(6.1,-5.9) 3(6.1,-4.8) 4(6.1,-3.7) 5(6.1,-2.6) 6(6.1,-1.5) 7(6.1,-0.4) 8(6.1,2.6) 9(6.1,3.7) 10(6.1,4.8) 11(6.1,5.9) 12(6.1,7) 13(-6.1,7) 14(-6.1,5.9) 15(-6.1,4.8) 16(-6.1,3.7) 17(-6.1,2.6) 18(-6.1,-0.4) 19(-6.1,-1.5) 20(-6.1,-2.6) 21(-6.1,-3.7) 22(-6.1,-4.8) 23(-6.1,-5.9) 24(-6.1,-7)
IND_BOURNS_CI160808
  rect 0.991x1.296 smd: 1(-0.75,0) 2(0.75,0)
INDC1006X60N
  rect 0.51x0.73 smd: 1(-0.46,0) 2(0.46,0)
L0603
  rect 0.8x0.864 smd: 1(-0.7,0.001) 2(0.7,0.001)
LED0402-RD
  rect 0.636x0.54 smd: 1(-0.538,0) 2(0.538,0)
LED0402-RD_BLUE
  rect 0.636x0.54 smd: 1(-0.538,0) 2(0.538,0)
LQFP-100_L14.0-W14.0-P0.50-LS16.0-BL
  oval 0.3x1.6 smd: 1(-6,-7.55) 2(-5.5,-7.55) 3(-5,-7.55) 4(-4.5,-7.55) 5(-4,-7.55) 6(-3.5,-7.55) 7(-3,-7.55) 8(-2.5,-7.55) 9(-2,-7.55) 10(-1.5,-7.55) 11(-1,-7.55) 12(-0.5,-7.55) 13(0,-7.55) 14(0.5,-7.55) 15(1,-7.55) 16(1.5,-7.55) 17(2,-7.55) 18(2.5,-7.55) 19(3,-7.55) 20(3.5,-7.55) 21(4,-7.55) 22(4.5,-7.55) 23(5,-7.55) 24(5.5,-7.55) 25(6,-7.55) 51(6,7.55) 52(5.5,7.55) 53(5,7.55) 54(4.5,7.55) 55(4,7.55) 56(3.5,7.55) 57(3,7.55) 58(2.5,7.55) 59(2,7.55) 60(1.5,7.55) 61(1,7.55) 62(0.5,7.55) 63(0,7.55) 64(-0.5,7.55) 65(-1,7.55) 66(-1.5,7.55) 67(-2,7.55) 68(-2.5,7.55) 69(-3,7.55) 70(-3.5,7.55) 71(-4,7.55) 72(-4.5,7.55) 73(-5,7.55) 74(-5.5,7.55) 75(-6,7.55)
  oval 1.6x0.3 smd: 26(7.55,-6) 27(7.55,-5.5) 28(7.55,-5) 29(7.55,-4.5) 30(7.55,-4) 31(7.55,-3.5) 32(7.55,-3) 33(7.55,-2.5) 34(7.55,-2) 35(7.55,-1.5) 36(7.55,-1) 37(7.55,-0.5) 38(7.55,0) 39(7.55,0.5) 40(7.55,1) 41(7.55,1.5) 42(7.55,2) 43(7.55,2.5) 44(7.55,3) 45(7.55,3.5) 46(7.55,4) 47(7.55,4.5) 48(7.55,5) 49(7.55,5.5) 50(7.55,6) 76(-7.55,6) 77(-7.55,5.5) 78(-7.55,5) 79(-7.55,4.5) 80(-7.55,4) 81(-7.55,3.5) 82(-7.55,3) 83(-7.55,2.5) 84(-7.55,2) 85(-7.55,1.5) 86(-7.55,1) 87(-7.55,0.5) 88(-7.55,0) 89(-7.55,-0.5) 90(-7.55,-1) 91(-7.55,-1.5) 92(-7.55,-2) 93(-7.55,-2.5) 94(-7.55,-3) 95(-7.55,-3.5) 96(-7.55,-4) 97(-7.55,-4.5) 98(-7.55,-5) 99(-7.55,-5.5) 100(-7.55,-6)
MCM-10_L2.5-W2.5-P0.50-BL-EP
  rect 0.52x0.5 smd: 1(-1.144,-1.2) 5(1.144,-1.2) 6(1.144,1.2) 10(-1.144,1.2)
  rect 0.3x0.5 smd: 2(-0.5,-1.2) 3(0,-1.2) 4(0.5,-1.2) 7(0.5,1.2) 8(0,1.2) 9(-0.5,1.2)
  rect 2.1x1.4 smd: 11(0,0)
MS621FE-FL11E
  rect 0.75x1.8 smd: +(0.75,0) -(-0.75,0)
OSC-SMD_L3.2-W1.5
  rect 1.05x1.7 smd: 1(-1.275,0) 2(1.275,0)
R0402
  rect 0.566x0.54 smd: 1(-0.433,0) 2(0.433,0)
R0603
  rect 0.806x0.864 smd: 1(-0.753,0) 2(0.753,0)
SMA_L4.4-W2.6-LS5.0-RD
  rect 1.8x1.7 smd: 1(-2.192,0) 2(2.192,0)
SOD-323_L1.8-W1.3-LS2.5-BI
  rect 0.985x0.49 smd: 1(-1.117,0) 2(1.117,0)
SOT-23-3_L3.0-W1.7-P0.95-LS2.9-BR
  rect 1.038x0.532 smd: 1(1.101,-0.95) 2(1.101,0.95) 3(-1.101,0)
SOT-23F_L2.9-W1.8-P0.95-LS2.4-BR
  rect 0.785x0.595 smd: 1(1.093,-0.95) 2(1.093,0.95) 3(-1.093,0)
TC2030-IDC-NL
  custom 0.787x0.787 smd: 1(0,-1.27) 2(0,0) 3(1.27,-1.27) 4(1.27,0) 5(2.54,-1.27) 6(2.54,0)

## Nets
As in the schematic.

Pads without a net: U1 1 2 3 4 11 13 14 15 P2 P3; U2 1 5 6 14 15 16 17 18 19; U3 1 2 3 4 5 6 7 15 17 18 32 36 38 39 40 41 42 43 44 45 46 47 51 52 53 55 56 57 59 60 61 62 63 64 65 66 67 68 69 70 71 77 78 79 80 81 82 83 84 85 87 88 90 91 92 93 95 96 97 98; X2 2 4

## Via types
v1: diameter 0.61, hole 0.305, Top Layer to Bottom Layer, 85 vias
v2: diameter 0.914, hole 0.457, Top Layer to Bottom Layer, 14 vias
v3: diameter 0.5, hole 0.305, Top Layer to Bottom Layer, 44 vias
v4: diameter 1.27, hole 0.635, Top Layer to Bottom Layer, 3 vias

## Routing (per net, layer and track width the routed paths; a pad name or vN(x,y) marks a point on that pad's centre or on a via; arc(x,y) is an arc through that point)
3V3_LED_NEN: length 10.6
  Top Layer w0.254: v1(16.89,0.89) 16.89,1.98 D3.1
  Bottom Layer w0.203: U3.37 23.6,5.45 23.6,3.86 20.62,0.89 v1(16.89,0.89)
+3V3: length 76.7
  Top Layer w0.203: v1(56.29,1.02) 56.29,1.13 R14.2 ; 62.74,8.84 R26.2 62.66,7.57 62.66,6.98 63.07,6.58 Q3.2
  Top Layer w0.229: R13.2 v1(51.08,1.88)
  Top Layer w0.254: C2.2 38.68,21.37 38.67,21.36 C5.2 40.69,21.35 40.69,20.29 40.97,20.02 v2(40.97,19.91) ; v1(15.19,5.54) 15.19,4.8 14.11,3.72 10.85,3.72 ; C7.1 39.81,4.34 v2(37.97,4.34) ; R9.1 12.17,2.23 10.85,2.23 10.85,3.72 ; 8.66,3.1 9.28,3.72 10.85,3.72 ; v1(12.9,18.46) 12.9,16.56 10.52,14.17 8.05,14.17 7.04,13.16 v1(7.04,12.5)
  Inner2 w0.254: v2(40.97,19.91) 30.04,19.91 v1(30.04,19.68)
  Bottom Layer w0.229: U3.28 28.08,4.56 27.61,4.09 27.61,3.42
  Bottom Layer w0.254: v1(12.9,18.46) 13.87,18.46 C11.2 14.35,18.02 U3.73 ; v1(15.19,5.54) 16.08,5.54 C10.2 17.08,5.44 ; U3.75 15.53,19.61 15.91,19.98 15.89,20 v1(15.89,20.95) ; 29.33,23.29 v1(28.02,23.29) ; 29.08,20.57 C14.2 30.04,20.56 v1(30.04,19.68) ; 30.63,14.02 31.63,14.02 C9.2 ; 32.16,14.52 32.23,14.46 32.23,13.58 ; v1(33.5,24.64) 33.5,23.3 R2.2 ; C8.2 L1.2 ; C8.2 35.3,4.86 ; C8.2 37.46,4.86 v2(37.97,4.34) ; R30.1 7.08,12.43 7.06,12.45 ; v2(62.74,1.12) 62.74,2.29 D1.2 ; C13.2 27.61,3.39 ; 27.61,3.39 27.61,3.42 ; 27.61,3.39 v1(27.61,2.67) ; v1(19.33,23.98) 18.73,23.38 R1.2
  vias: v2(62.74,8.84) v1(32.23,13.69)
GND: length 65.4
  Top Layer w0.229: U2.12 44.97,14.88 45.17,14.68 46.96,14.68 47.17,14.89 U2.10
  Top Layer w0.254: 6.12,3.1 5.46,2.44 v1(3.5,2.44) ; v1(54.41,14.15) 53.11,14.15 52.37,14.89 U2.7
  Bottom Layer w0.203: C17.1 32.71,10.12 v1(33.12,9.7)
  Bottom Layer w0.229: C22.1 40.66,13.17 v1(41,13.51) ; U3.27 28.58,4.5 28.27,4.19 28.27,3.82 C13.1 ; v1(17.07,3.78) 17.58,4.3 U3.49 ; v1(16.97,18.42) 16.87,18.52 U3.74
  Bottom Layer w0.254: R25.1 12.71,9.47 v1(13.64,9.47) ; v1(13.89,20.54) C11.1 14.31,19.98 C12.1 ; C10.1 16.5,4.35 v1(17.07,3.78) ; v1(20.37,3.53) 19.49,3.53 ; C14.1 30.72,21.66 v1(31.09,21.28) ; 30.06,21.61 30.06,21.6 ; 30.63,9.52 30.63,10.02 32.18,10.02 C17.1 ; 32.28,6.84 32.28,6.03 32.64,5.66 v2(33.07,5.66) ; C9.1 33.24,14.51 v1(33.55,13.84) ; C16.1 C15.1 33.07,6.18 33.07,5.16 33.37,4.86 C8.1 ; C21.1 35.05,12.54 35.33,12.26 35.33,11.86 v1(35.3,11.83) ; v1(35.27,15.72) C20.1 ; v1(35.3,21.53) C19.1 ; Q2.2 39.89,24.57 v1(39.9,24.56) ; U6.4 49.94,6.83 ; U3.99 28.58,16.42 v1(28.58,16.41) 28.58,15.65 29.7,14.52 30.63,14.52 ; v2(62.71,10.29) 60.9,10.29 BT1.- ; v1(34.21,10.87) 34.21,11.01 C23.1 ; U6.6 49.3,9.04 49.4,8.94 U6.11 50.47,8.92 51.54,8.92 51.59,8.86 U6.1 51.87,7.46 C24.1 51.87,6.3 50.57,5 49.76,5 ; C13.1 29.64,3.35 v1(29.72,3.43) ; U6.9 50.94,10.52 51.33,10.91 C26.1 ; v1(24.71,24.87) 24.37,24.52 Q1.2
  Bottom Layer w0.305: 59.57,5.49 59.57,6.29 59.11,6.76 v2(58.34,6.76)
  vias: v2(8.05,18.69) v2(40.89,15.98) v2(41.25,11.61) v2(42.93,15.62) v2(44.98,1.98) v2(60.17,2.95) v1(25.02,1.12) v1(31.5,1.55) v1(38.35,2.08) v1(39.83,18.9) v1(40.69,23.6) v1(41.17,4.24) v1(41.73,7.09) v1(42.34,24.08) v1(45.34,5.97) v1(49.12,23.42) v1(51.33,13.98) v3(41.71,10.85) v3(42.04,15.29) v3(42.09,13.11) v3(42.34,20.12) v3(42.8,19.38) v3(42.8,16.61) v3(42.77,14.1) v3(44.55,21.77) v3(44.55,20.85) v3(44.91,6.88) v3(44.98,17.73) v3(45.03,13.21) v3(45.69,14.07) v3(46.05,21.81) v3(46.05,8.86) v3(46.53,12.52) v3(47.19,18.67) v3(47.55,21.77) v3(47.55,20.85) v3(47.98,9.91) v3(48.23,6.88) v3(48.54,10.95) v3(48.56,8.84) v3(49.68,9.27) v3(49.68,8.64) v3(50.29,24.71) v3(50.27,20.6) v3(50.24,19.28) v3(50.44,9.27) v3(50.44,8.64) v3(50.6,4.11) v3(51.21,9.27) v3(51.21,8.64) v3(51.23,4.65) v3(52.65,9.96) v3(52.65,8.37) v3(52.65,6.86) v3(54.25,11.38) v3(54.25,9.96) v3(54.25,8.36) v3(54.25,6.86) v3(54.74,10.69) v3(54.74,9.14) v3(54.74,7.59)
VCC_RF: length 21.2
  Top Layer w0.254: v1(42.32,11.99) 45.11,11.99 48.27,15.15 U2.9
  Top Layer w0.635: U2.9 48.27,17.19 arc(48.53,17.81) R3.1
  Bottom Layer w0.254: L5.1 44.86,4.95 42.32,7.49 v1(42.32,11.99)
ANT: length 2.1
  Top Layer w0.254: J1.1 34.77,5.51 U1.12
BOOT0: length 32.2
  Top Layer w0.254: v1(9.09,10.06) 9.09,12.29 9.45,12.65 17.3,12.65 23.19,18.54 25.96,18.54 v1(26.06,18.64)
  Bottom Layer w0.254: v1(26.06,18.64) 26.08,18.67 U3.94 ; v1(9.09,10.06) 9.09,9.78 5.82,6.5 J4.6
EXT_RX: length 34.7
  Top Layer w0.254: v1(29.08,4.19) 28.91,4.01 24.36,4.01 23.24,2.9 11.48,2.9 v1(11.43,2.95) ; v1(5.94,4.44) 5.94,8.51 v1(5.97,8.53)
  Bottom Layer w0.254: v1(5.94,4.44) 5.99,4.5 9.52,4.5 11.07,2.95 v1(11.43,2.95) ; U3.26 v1(29.08,4.19) ; v1(5.97,8.53) 2.92,11.58 J4.4
EXT_TX: length 39.7
  Top Layer w0.254: v1(25.2,9.68) 25.22,9.7 28.98,9.7 29.41,9.27 29.41,7.29 v1(28.98,6.86) ; v1(19.1,18.49) 17.88,19.71 11.56,19.71 5.89,14.05 2.36,14.05 J4.3
  Bottom Layer w0.254: 19.13,18.47 25.2,12.39 v1(25.2,9.68) ; v1(28.98,6.86) 30.48,6.86 30.63,7.02
EXTINT: length 51.5
  Top Layer w0.254: 53,18.29 53,17.84 53.39,17.45 55.37,17.45 55.67,17.15 55.67,16.13 ; v1(55.65,14.2) 55.67,14.22 U2.4
  Bottom Layer w0.254: U3.35 24.58,3.86 24.28,3.56 24.28,2.79 26.57,0.51 42.19,0.51 44.91,3.23 52.12,3.23 55.65,6.76 v1(55.65,14.2)
GPS_ANT: length 10.4
  Top Layer w0.635: D4.2 v4(43.99,18.06) arc(45.08,18.72) J2.1
  Bottom Layer w0.635: 47.52,19.74 arc(47.52,19.72) 47.5,19.71 44.98,19.71 arc(44.28,19.42) 43.99,18.72 v4(43.99,18.06) 43.99,16.31 arc(44,16.29) D.1
GPS_NEN: length 41.4
  Top Layer w0.203: Q3.1 61.87,5.4 R26.1 61.85,7.62 61.44,7.62 60.73,8.33 60.73,12.19 60.3,12.62 49,12.62 46.33,9.96 34.04,9.96 v1(33.38,10.62)
  Bottom Layer w0.254: 33.45,10.69 v1(33.38,10.62) 33.1,10.9 32.08,10.9 31.46,11.52 30.63,11.52
GPS_RX: length 42
  Top Layer w0.254: 55.49,1.88 55.67,2.06 U2.21 55.67,4.7 ; 55.67,4.7 55.67,5.01 ; 55.67,4.7 54.48,5.89 48.13,5.89 44.55,9.47 34.95,9.47 31.78,6.3 31.78,4.22 29.62,2.06 27.25,2.06 v1(25.93,3.38)
  Bottom Layer w0.254: U3.33 25.58,3.73 25.93,3.38
GPS_TX: length 41.7
  Top Layer w0.254: 53.86,1.88 54.57,2.58 U2.20 54.57,4.9 54.16,5.31 47.9,5.31 44.2,9.02 35.18,9.02 32.28,6.12 32.28,4.04 29.82,1.58 26.8,1.58 v1(25.04,3.33)
  Bottom Layer w0.254: U3.34 25.1,5.45 25.1,3.38 v1(25.04,3.33)
GPS_VIN: length 43
  Top Layer w0.254: 51.38,17.02 51.38,18.24
  Top Layer w0.305: v1(60.71,6.98) 60.71,5.33 Q3.3 61.19,4.85 61.19,1.45 60.66,0.91 58.8,0.91 58.6,1.12 58.6,1.7 58.57,1.73 ; 61.54,13.13 61.54,17.36 R6.2 ; 61.54,13.13 v1(61.54,8.74) ; 61.54,13.13 50.01,13.13 v1(49.96,13.18) 49.96,14.07 51.38,15.49 51.38,16.99
  Top Layer w0.394: U2.23 57.89,3.86 57.89,2.57 58.57,1.88 58.57,1.73
  Bottom Layer w0.254: v1(61.54,8.74) 61.54,7.82 v1(60.71,6.98)
  Bottom Layer w0.305: 49.8,15.21 49.96,15.05 v1(49.96,13.18)
MIC_IN: length 24.1
  Top Layer w0.254: U1.18 11.05,8.48 26.77,8.48 27.15,8.86 v1(27.46,8.86)
  Bottom Layer w0.254: 27.58,5.47 27.58,7.72 27.46,7.85 27.46,8.86
NRST: length 38.1
  Top Layer w0.254: v1(5.97,11.81) 6.02,11.81 ; v1(28.58,12.52) 26.97,10.92 25.58,10.92 23.49,8.84 7.8,8.84 7.42,9.22 7.42,9.4 7.31,9.5 v1(6.81,9.5) 6.81,3.73 6.78,3.71 7.39,3.1
  Bottom Layer w0.254: v1(6.81,9.5) 6.68,9.37 6.1,9.37 5.64,9.83 5.64,10.7 R30.2 5.52,10.82 5.52,11.36 v1(5.97,11.81) ; C23.2 32.1,11.81 31.39,12.52 30.63,12.52 30.63,12.52 v1(28.58,12.52)
OSC16_OUT: length 7.7
  Bottom Layer w0.254: 31.71,12.74 31.88,12.57 33.83,12.57 34.09,12.32 34.09,11.89 35.71,10.27 R16.2 ; 31.71,12.74 31.72,12.74 ; 31.71,12.74 31.43,13.02 30.63,13.02
PERIPH: length 8.5
  Top Layer w0.635: 45.48,24.41 45.45,24.38 v4(43.84,24.38)
  Bottom Layer w0.635: A.1 48.46,21.52 arc(48.11,22.38) 47.24,22.73 44.73,22.73 arc(44.1,22.99) 43.84,23.62 v4(43.84,24.38)
PPS_OUT: length 64.8
  Top Layer w0.254: v1(43.23,8) 43.79,7.44 43.79,1.7 42.55,0.46 20.15,0.46 19.67,0.94 19.67,1.97 19.66,1.98 v1(18.49,1.98) ; R5.2 53.88,19.05 50.88,19.05 50.29,18.47 50.29,15.14 46.1,10.95 v1(43.23,10.95)
  Bottom Layer w0.254: U3.54 14.27,8.52 14.02,8.26 14.02,4.06 16.1,1.98 v1(18.49,1.98) ; v1(43.23,8) v1(43.23,10.95)
PTT: length 7.2
  Top Layer w0.254: v1(24.28,21.89) 24.28,22.8 24.77,23.28 U1.5
  Bottom Layer w0.254: 22.95,22.33 23.03,22.25 23.83,22.25 24.18,21.89 v1(24.28,21.89) ; R1.1 22.6,22.68 Q1.3
PTT_IN: length 12.7
  Bottom Layer w0.254: Q1.1 21.84,24.69 18.64,24.69 17.4,23.44 17.4,21.89 17.42,21.87 21.92,21.87 22.08,21.71 U3.86
PWR_LVL: length 6.5
  Top Layer w0.254: U1.7 36.01,23.28 36.4,22.89 v1(36.4,21.82)
  Bottom Layer w0.254: R2.1 35.04,23.17 v1(36.4,21.82) 36.4,21.91 36.86,22.37 Q2.3
PWR_LVL_IN: length 28.4
  Top Layer w0.254: v1(27.76,15.7) 32.89,15.7 37.06,19.86 37.06,22.71 37.82,23.47 v1(37.82,24.84)
  Bottom Layer w0.254: v1(37.82,24.84) 37.55,24.57 Q2.1 ; v1(27.76,15.7) 26.14,14.07 26.14,6.89 26.58,6.44 U3.31
RESET_N: length 3.9
  Top Layer w0.254: v1(48.23,13.97) 49.37,15.1 U2.8
  Bottom Layer w0.305: R4.1 48.29,14.03 v1(48.23,13.97)
RF_IN: length 7.5
  Top Layer w0.635: v4(46.08,17.83) 46.08,16.1 arc(46.07,16.09) U2.11
  Bottom Layer w0.635: 49.3,21.28 49.3,20.57 48.47,19.73 48.4,19.73 arc(48.41,19.73) 48.41,19.71 C.2 arc(47.97,18.12) 47.45,17.91 arc(46.77,17.8) v4(46.08,17.83)
SLEEP: length 22.5
  Top Layer w0.254: v1(32.18,23.29) 32.17,23.28 U1.6 27.08,19.92 v1(27.08,12.98)
  Bottom Layer w0.254: 30.92,23.29 v1(32.18,23.29) ; U3.30 27.08,5.47 27.08,7.49 26.7,7.87 26.7,12.6 v1(27.08,12.98)
SWCLK: length 36.2
  Top Layer w0.254: 10.77,0.89 10.77,1.07 10.57,1.27 9.5,1.27 9.25,1.02 7.9,1.02 7.39,1.52 J3.4 ; v1(10.59,10.72) 11.51,11.63 18.67,11.63 v1(18.69,11.61)
  Bottom Layer w0.254: v1(10.77,0.64) 10.77,1.07 11.07,1.37 13.49,1.37 13.49,3.1 10.59,5.99 v1(10.59,10.72) ; U3.76 17.07,20.55 17.07,19.3 18.69,17.68 v1(18.69,11.61)
SWDIO: length 37.2
  Top Layer w0.254: 11.56,0.64 11.56,1.17 11.07,1.65 8.84,1.65 J3.2 ; v1(17.55,17.53) 13.49,13.46 8.74,13.46 7.95,12.67 7.95,9.3 10.72,9.3 v1(11.33,9.91)
  Bottom Layer w0.254: v1(17.55,17.53) 17.54,17.52 U3.72 ; 11.56,0.64 13.97,0.64 14.12,0.79 14.12,3.28 11.33,6.07 v1(11.33,9.91)
  vias: v1(11.53,0.64)
SWO: length 38.2
  Top Layer w0.254: v1(23.57,16.97) 22.55,16.97 17.6,12.01 10.64,12.01 9.78,11.15 v1(9.78,10.72) ; J3.6 6.12,1.73 7.21,0.64 v1(10.01,0.64)
  Bottom Layer w0.254: v1(9.78,10.72) 9.78,5.97 12.83,2.92 12.83,2.11 11.05,2.11 10.01,1.07 v1(10.01,0.64) ; v1(23.57,16.97) 23.57,20.55 U3.89
V_BCKP: length 10.5
  Top Layer w0.254: v2(56.77,5.54) 56.77,5.54 U2.22
  Bottom Layer w0.254: v2(56.77,5.54) 56.74,5.56 56.74,7.09 58.91,9.26 BT1.+
  Bottom Layer w0.305: C6.2 58.43,5.54 v2(56.77,5.54) 55.67,4.44 R7.1
VEN: length 5.7
  Bottom Layer w0.254: L5.2 47.29,5.87 C25.2 50.22,5.87 C24.2 50.94,6.66 U6.2 U6.3
VHF_RX: length 16.1
  Top Layer w0.254: v1(28.65,8.84) 28.73,8.76 28.73,7.49 28.4,7.16 18.62,7.16 U1.16
  Bottom Layer w0.254: v1(28.65,8.84) 29.49,8 30.62,8 30.63,8.02
VHF_TX: length 19.2
  Top Layer w0.254: U1.17 14.63,7.62 27.69,7.62 v1(28.14,8.08)
  Bottom Layer w0.254: v1(28.14,8.08) 28.71,7.51 30.63,7.51 30.63,7.52
VSYS: length 14.9
  Bottom Layer w0.254: R24.2 13.25,12.04 9.83,12.04 8.31,10.52 8.31,9.8 5.92,7.42 3.91,7.42 J4.5
XLNA: length 6
  Bottom Layer w0.635: 53.21,14.07 53.21,14.53 C.1
$2N1313: length 3.1
  Top Layer w0.254: U2.2 57.87,17.56 58.57,18.26 59.14,18.26 R6.1
$2N1327: length 2.2
  Bottom Layer w0.305: D1.1 57.13,2.93 R7.2
$2N11296: length 8.1
  Top Layer w0.635: L2.1 48.97,24.41 arc(49.82,24.06) 50.17,23.22 50.17,22.19 arc(49.87,21.47) C4.2 R3.2
$2N11769: length 3.7
  Bottom Layer w0.635: C28.1 53.21,11.77 U6.10
$2N11796: length 10.5
  Bottom Layer w0.635: U6.5 48.27,7.74 44.02,11.99 D.2
$2N19088: length 1.4
  Bottom Layer w0.254: L4.1 49.48,11.22 49.94,10.75 U6.7
$2N19111: length 3.1
  Bottom Layer w0.254: U6.8 50.44,11.28 50.4,11.33 50.44,11.38 50.44,12.12 50.83,12.5 C26.2
$3N108: length 1.8
  Top Layer w0.254: R9.2 15.74,1.91 D3.2
+3V3A: length 4.9
  Bottom Layer w0.254: 30.63,8.52 31.64,8.52 C16.2 C15.2 L1.1
OSC16_IN: length 6.4
  Bottom Layer w0.254: 30.63,13.52 31.51,13.52 31.95,13.08 33.78,13.08 34.33,13.63 34.71,13.63 ; 34.71,13.63 C21.2 ; 34.71,13.63 36.61,13.63
OSC32_IN: length 9.6
  Bottom Layer w0.254: 30.63,15.52 31.44,15.52 31.97,16.05 31.97,20.8 32.71,21.53 C19.2 33.33,19.9 X1.1
OSC32_OUT: length 4.6
  Bottom Layer w0.254: 30.63,15.02 31.53,15.02 32.23,15.72 C20.2 33.31,17.32 X1.2
PPS: length 2.4
  Top Layer w0.254: R5.1 56.35,18.08 56.35,17.58 56.77,17.16 U2.3
VCAP: length 1.9
  Bottom Layer w0.254: U3.48 18.09,5.46 C18.2
VREF+: length 1.6
  Bottom Layer w0.254: 30.63,9.02 30.64,9.03 C17.2
VSYS_IN: length 3
  Bottom Layer w0.254: R25.2 13.91,10.5 13.92,10.51 R24.1 15.52,10.51 U3.58
$1N2852: length 3.6
  Bottom Layer w0.254: 38.46,10.29 38.46,12.08 X2.3 C22.2
$2N14994: length 2.1
  Top Layer w0.254: 21.18,1.97 23.23,1.97 D2.2

## Copper pours and planes (outline as drawn; the poured copper is in the pictures)
+3V3 on Inner2: 0.25,25.6 40.28,25.6 40.28,-0.15 0.25,-0.15
+3V3 on Inner2: 0.25,25.6 40.28,25.6 40.28,3.68 55.3,3.68 55.3,25.6 64.06,25.6 64.06,-0.15 0.25,-0.15
GND on Top Layer: 0.25,25.6 64.06,25.6 64.06,-0.15 0.25,-0.15
GND on Bottom Layer: 40.28,25.6 64.06,25.6 64.06,-0.1 40.28,-0.1
GND on Inner1: 0.26,25.24 63.62,25.24 63.62,0.26 0.26,0.26
GND on Inner2: 40.28,25.6 55.3,25.6 55.3,3.68 40.28,3.68

Small or netless copper shapes (teardrops, artwork), in the pictures only: 4 on Inner1

## Text on the board
Bottom Silkscreen Layer: RX | TX | GND | VSYS | +3V3 | BOOT0 | April 2024 | Project CETI | Recovery V2.3 | PASS:B / ACTV:A+B / XLNA:C+D
Top Silkscreen Layer: DEBUG | 3V3 | PPS
